# Altium schematic sheet CH9374.SchDoc
size A4
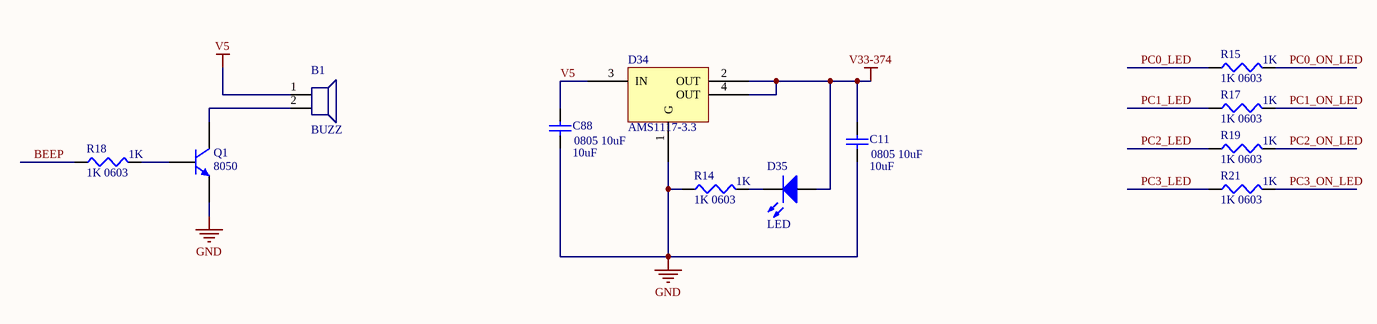
[diagram p0: CH9374.SchDoc]

## Parts
B1  BUZZ  [BUZZ]
C11  0805 10uF  value 10uF  [C0805]
C88  0805 10uF  value 10uF  [C0805]
D34  AMS1117-3.3  [SOT-223]
D35  LED  [LED0603]
Q1  8050  [TO-226-AA]
R14  1K 0603  value 1K  [R0603]
R15  1K 0603  value 1K  [R0603]
R17  1K 0603  value 1K  [R0603]
R18  1K 0603  value 1K  [R0603]
R19  1K 0603  value 1K  [R0603]
R21  1K 0603  value 1K  [R0603]

## Nets
GND: C11.1 C88.1 D34.1(G) Q1.3(E) R14.1
V5: B1.1(VCC) C88.2 D34.3(IN)
V33-374: C11.2 D34.2(OUT) D34.4(OUT) D35.1(A)
BEEP: R18.1
PC0_LED: R15.1
PC0_ON_LED: R15.2
PC1_LED: R17.1
PC1_ON_LED: R17.2
PC2_LED: R19.1
PC2_ON_LED: R19.2
PC3_LED: R21.1
PC3_ON_LED: R21.2
NetB1_2: B1.2(GND) Q1.1(C)
NetD35_2: D35.2(K) R14.2
NetQ1_2: Q1.2(B) R18.2

## Library data of the parts
C11 C88 = Cap Semi: Capacitor (Semiconductor SIM Model); Published: 8-Jun-2000; LatestRevisionDate: 29-May-2009; LatestRevisionNote: IPC-7351 Footprint Added.; PackageReference: C1206; Publisher: Altium Limited; PackageDescription: Chip Capacitor
Q1 = NPN: NPN Bipolar Transistor; Published: 8-Jun-2000; LatestRevisionDate: 17-Jul-2002; LatestRevisionNote: Re-released for DXP Platform.; PackageReference: TO-226-AA; Publisher: Altium Limited; PackageDescription: TO, Flat Index; 3 In-Line, Axial Leads; Body Dia. 4.8mm; Leads 0.55 x 0.51 mm (max); Code_JEDEC: TO-226-AA
R14 R15 R17-R19 R21 = Res3: Resistor; Published: 8-Jun-2000; LatestRevisionDate: 29-May-2009; LatestRevisionNote: IPC-7351 Footprint Added.; Publisher: Altium Limited; PackageDescription: Chip Resistor
  R14 R15: PackageReference: J1-0603
  R17-R19 R21: PackageReference: R0603